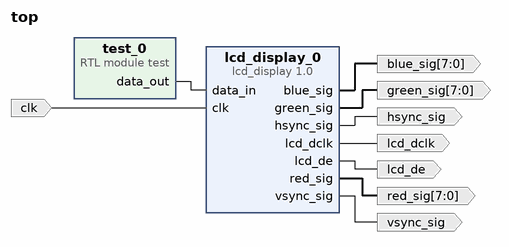
[diagram p0: block diagram of the top level]
# Vivado block design top, xc7z010clg400-1, Vivado 2017.2
create_bd_design top

create_bd_port -dir O -from 7 -to 0 blue_sig
create_bd_port -dir I -type clk clk
create_bd_port -dir O -from 7 -to 0 green_sig
create_bd_port -dir O hsync_sig
create_bd_port -dir O lcd_dclk
create_bd_port -dir O lcd_de
create_bd_port -dir O -from 7 -to 0 red_sig
create_bd_port -dir O vsync_sig

create_bd_cell -type ip -vlnv fudan_university:peter:lcd_display:1.0 lcd_display_0
create_bd_cell -type module -reference test test_0

# ---- connections ----

connect_bd_net [get_bd_pins test_0/data_out] [get_bd_pins lcd_display_0/data_in]
connect_bd_net [get_bd_pins lcd_display_0/blue_sig] [get_bd_ports blue_sig]
connect_bd_net [get_bd_ports clk] [get_bd_pins lcd_display_0/clk]
connect_bd_net [get_bd_pins lcd_display_0/green_sig] [get_bd_ports green_sig]
connect_bd_net [get_bd_pins lcd_display_0/hsync_sig] [get_bd_ports hsync_sig]
connect_bd_net [get_bd_pins lcd_display_0/lcd_dclk] [get_bd_ports lcd_dclk]
connect_bd_net [get_bd_pins lcd_display_0/lcd_de] [get_bd_ports lcd_de]
connect_bd_net [get_bd_pins lcd_display_0/red_sig] [get_bd_ports red_sig]
connect_bd_net [get_bd_pins lcd_display_0/vsync_sig] [get_bd_ports vsync_sig]

validate_bd_design
save_bd_design
